# EAGLE design io-board (EAGLE 6.3)
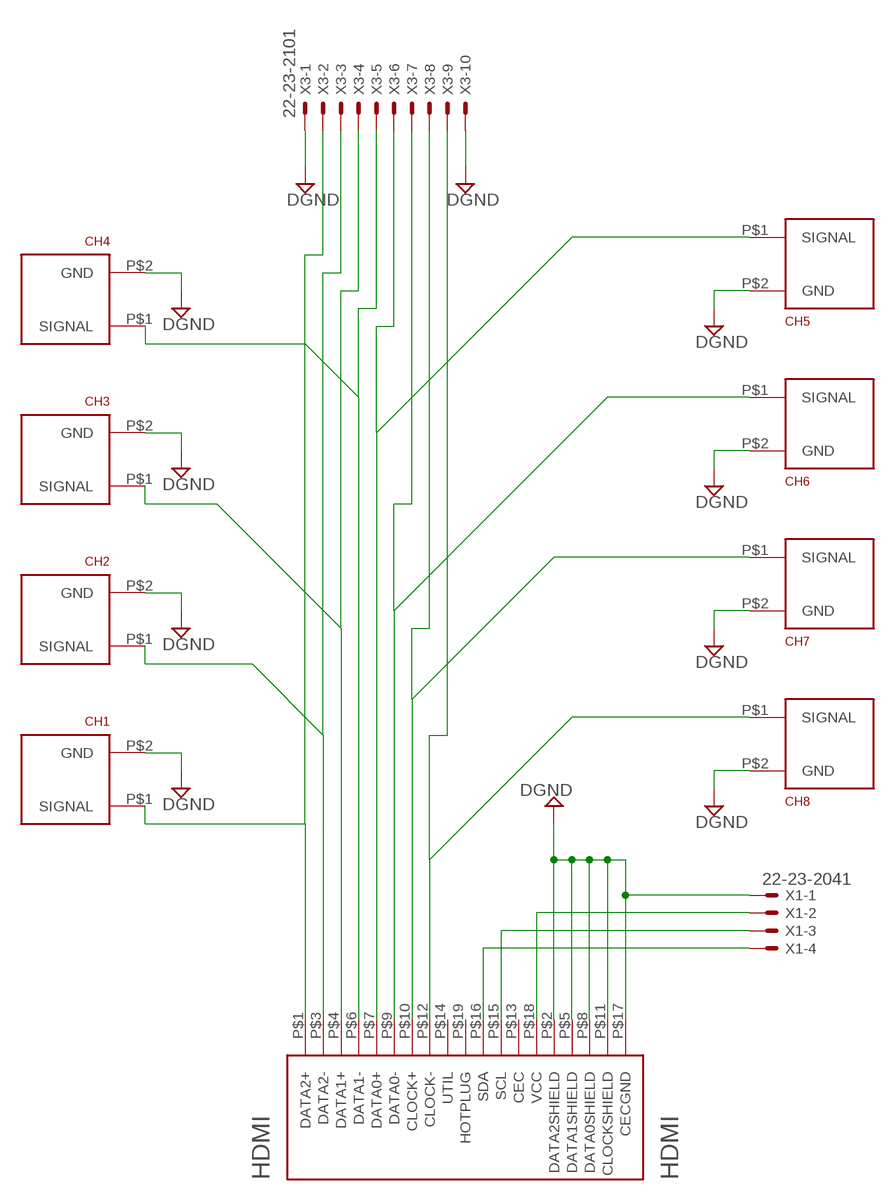
[diagram p0: schematic, sheet 1]

## Parts
CH1  BNC_VERTICAL  [BNC_VERTICAL]
CH2  BNC_VERTICAL  [BNC_VERTICAL]
CH3  BNC_VERTICAL  [BNC_VERTICAL]
CH4  BNC_VERTICAL  [BNC_VERTICAL]
CH5  BNC_VERTICAL  [BNC_VERTICAL]
CH6  BNC_VERTICAL  [BNC_VERTICAL]
CH7  BNC_VERTICAL  [BNC_VERTICAL]
CH8  BNC_VERTICAL  [BNC_VERTICAL]
HDMI  HDMI  [HDMI_A]
X1  22-23-2041  [22-23-2041]
X3  22-23-2101  [22-23-2101]

## Nets
CH6: CH6.P$1(SIGNAL) HDMI.P$9(DATA0-) X3.7
DGND: CH1.P$2(GND) CH2.P$2(GND) CH3.P$2(GND) CH4.P$2(GND) CH5.P$2(GND) CH6.P$2(GND) CH7.P$2(GND) CH8.P$2(GND) HDMI.P$2(DATA2SHIELD) HDMI.P$5(DATA1SHIELD) HDMI.P$8(DATA0SHIELD) HDMI.P$11(CLOCKSHIELD) HDMI.P$17(CECGND) X1.1 X3.1 X3.10
I2C_CLK: HDMI.P$15(SCL) X1.3
I2C_DAT: HDMI.P$16(SDA) X1.4
N$2: CH3.P$1(SIGNAL) HDMI.P$4(DATA1+) X3.4
N$3: CH2.P$1(SIGNAL) HDMI.P$3(DATA2-) X3.3
N$4: CH1.P$1(SIGNAL) HDMI.P$1(DATA2+) X3.2
N$5: CH5.P$1(SIGNAL) HDMI.P$7(DATA0+) X3.6
N$7: CH7.P$1(SIGNAL) HDMI.P$10(CLOCK+) X3.8
N$8: CH8.P$1(SIGNAL) HDMI.P$12(CLOCK-) X3.9
N$23: CH4.P$1(SIGNAL) HDMI.P$6(DATA1-) X3.5
VCC: HDMI.P$18(VCC) X1.2
Unconnected: HDMI.P$13(CEC) HDMI.P$14(UTIL) HDMI.P$19(HOTPLUG)

## Library data of the parts
CH1-CH8 = josh:BNC_VERTICAL
HDMI = open-ephys:HDMI: Horizonal HDMI type "A" jack
X1 = con-molex:22-23-2041: .100" (2.54mm) Center Header - 4 Pin; MF: MOLEX; MPN: 22-23-2041; OC_FARNELL: 1462920; OC_NEWARK: 38C0355
X3 = con-molex:22-23-2101: .100" (2.54mm) Center Header - 10 Pin; MF: MOLEX; MPN: 22-23-2101; OC_FARNELL: 1756828; OC_NEWARK: 94C0765

## Board
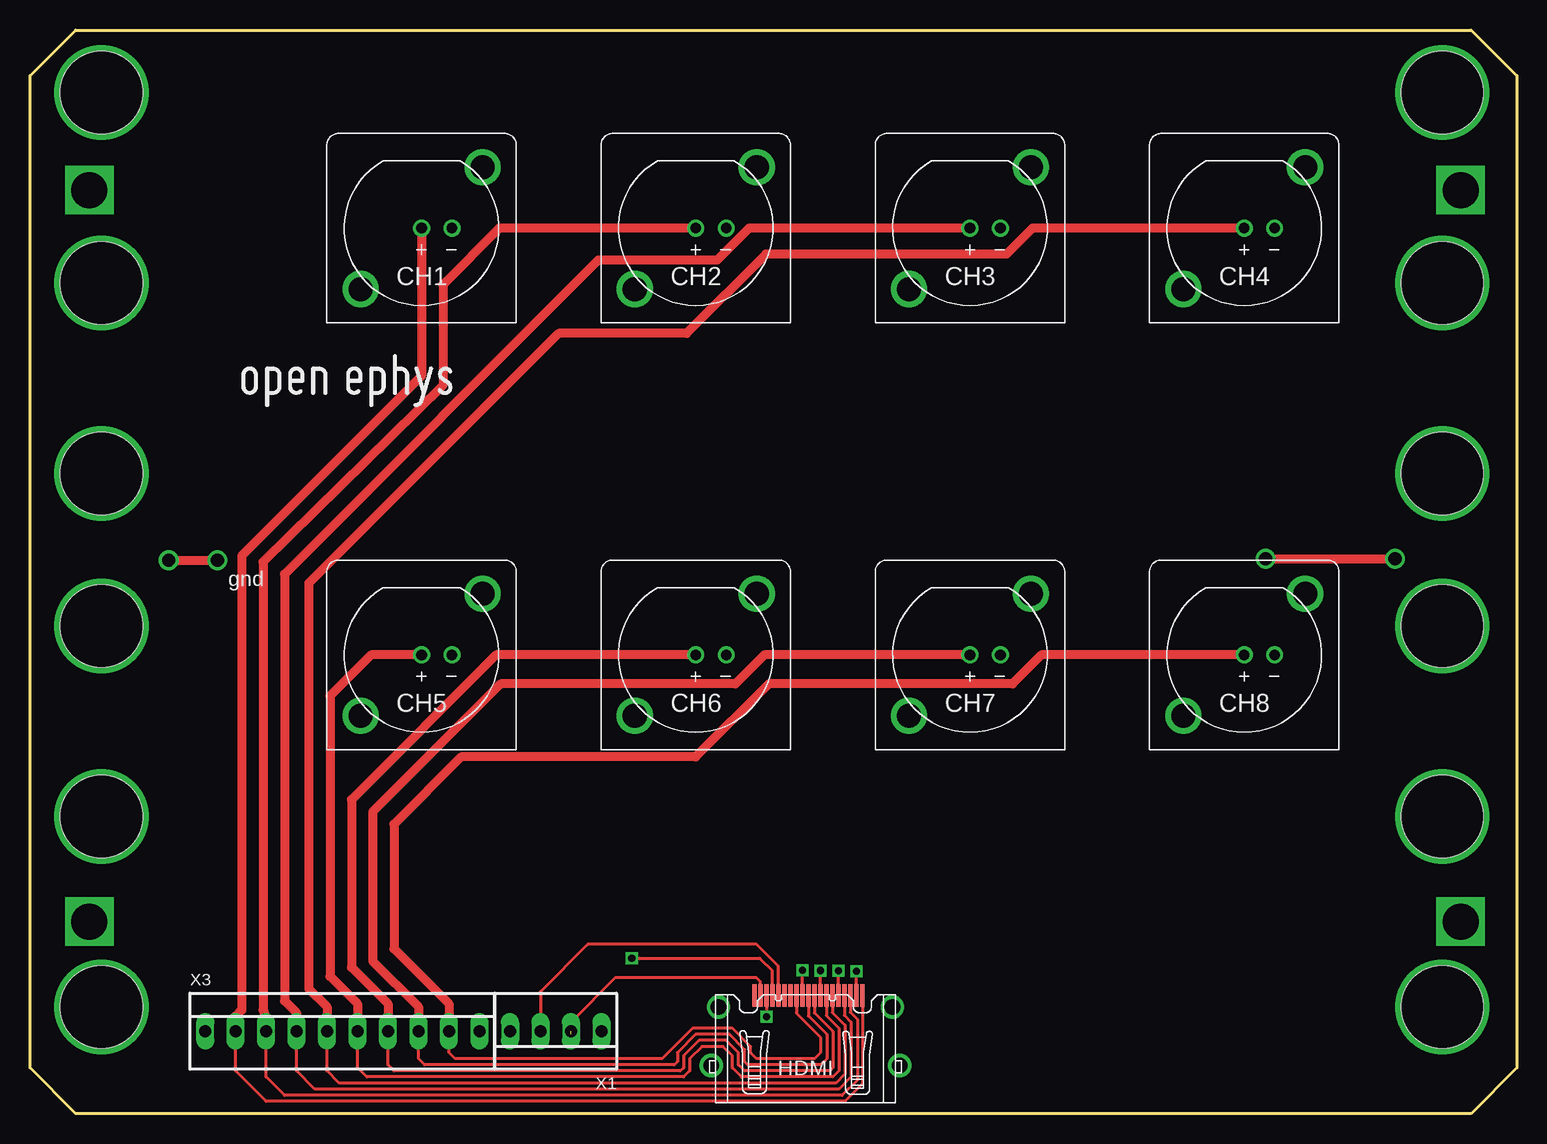
[diagram p1: board, top side]
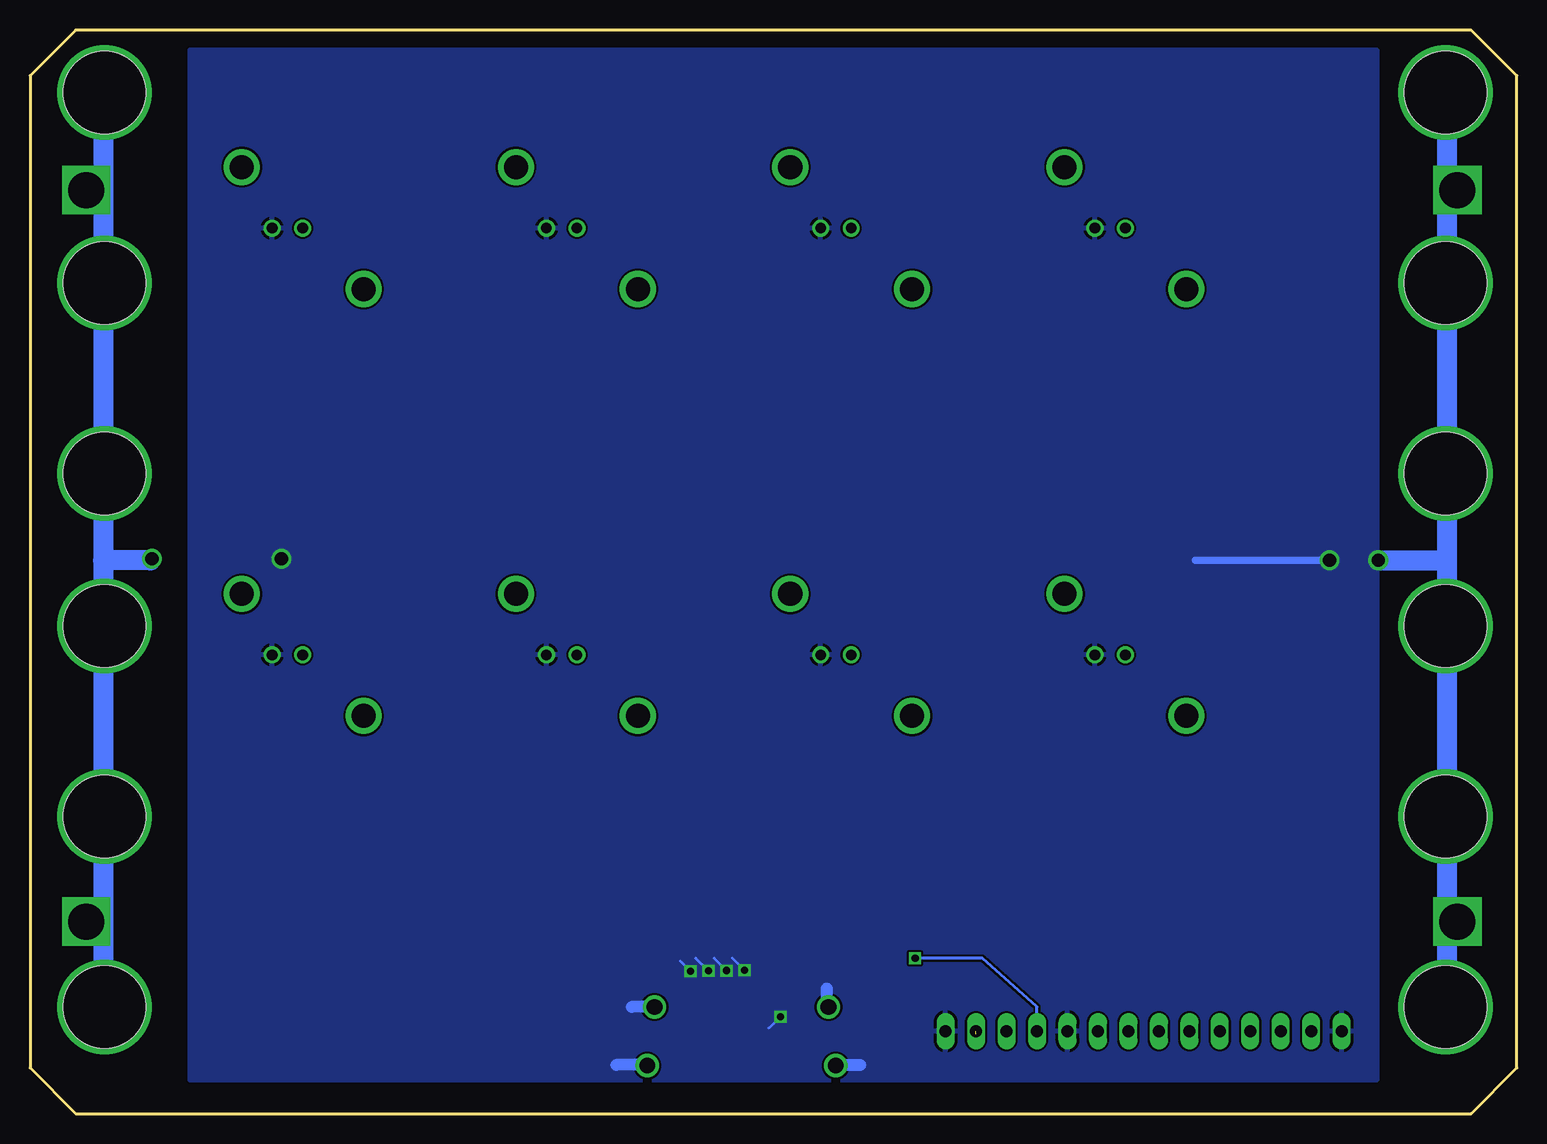
[diagram p2: board, bottom side, seen from below]

Size 123.95 x 90.3 mm. Coordinates in mm from the lower left corner, seen from the top.
Outline: 120.14,0 3.81,0 0,3.81 0,86.49 3.81,90.3 120.14,90.3 123.95,86.49 123.95,3.81 120.14,0
Copper layers (1*16): Top 0.035mm / dielectric 1.5mm / Bottom 0.035mm
Design rules "default": minimum track width 10mil, minimum drill 10mil, track to track 7mil, track to pad 7mil, pad to pad 7mil, via to via 7mil, smd to smd 7mil, copper to edge 25mil, drill to drill 7mil, minimum pad ring 10mil, minimum via ring 8mil, stop-mask expansion 4mil, vias tented up to drill 0mil, thermal gap 10mil
Holes 6.86 mm at 5.97,85.09 5.97,69.22 5.97,53.34 5.97,40.64 5.97,24.77 5.97,8.89 117.73,85.09 117.73,69.22 117.73,53.34 117.73,40.64 117.73,24.77 117.73,8.89

### Footprints (pad centres in the part's own frame; a part is rotated, then mirrored left to right if it is on the bottom)
BNC_VERTICAL = drill 0.89: P$1 0,0; P$2 2.54,0 | drill 2.01: P$3 5.08,5.08; P$4 -5.08,-5.08
HDMI_A = smd 0.3 x 1.9: P$1 4.75,0.95; P$2 4.25,0.95; P$3 3.75,0.95; P$4 3.25,0.95; P$5 2.75,0.95; P$6 2.25,0.95; P$7 1.75,0.95; P$8 1.25,0.95; P$9 0.75,0.95; P$10 0.25,0.95; P$11 -0.25,0.95; P$12 -0.75,0.95; P$13 -1.25,0.95; P$14 -1.75,0.95; P$15 -2.25,0.95; P$16 -2.75,0.95; P$17 -3.25,0.95; P$18 -3.75,0.95; P$19 -4.25,0.95 | drill 1.3: P$20 -7.25,0; P$21 7.25,0; P$22 7.85,-4.9; P$23 -7.85,-4.9
22-23-2041 = drill 1 long: 1 -3.81,0; 2 -1.27,0; 3 1.27,0; 4 3.81,0
22-23-2101 = drill 1 long: 1 -11.43,0; 2 -8.89,0; 3 -6.35,0; 4 -3.81,0; 5 -1.27,0; 6 1.27,0; 7 3.81,0; 8 6.35,0; 9 8.89,0; 10 11.43,0

### Placement (x,y rotation side)
CH1  32.64,73.79 0 top
CH2  55.5,73.79 0 top
CH3  78.36,73.79 0 top
CH4  101.22,73.79 0 top
CH5  32.64,38.23 0 top
CH6  55.5,38.23 0 top
CH7  78.36,38.23 0 top
CH8  101.22,38.23 0 top
HDMI  64.64,8.89 0 top
U$2  [OPEN_EPHYS_LOGO]  17.02,58.42 0 top
X1  43.81,6.86 180 top
X3  26.04,6.86 0 top

### Tracks (layer width: path | path; a pad name or v marks a point on that pad's centre or on a via)
CH6
  Top 0.254: 65.41,9.6 HDMI.P$9 65.39,8.39 66.93,6.86 66.93,3.81 66.68,3.56 59.56,3.56 59.05,4.06 59.05,5.08 58.04,6.1 55.75,6.1 54.48,4.83 54.48,3.81 54.23,3.56 30.35,3.56 29.85,4.06 X3.7
  Top 0.762: CH6.P$1 38.86,38.23 26.8,26.16 26.8,12.19 29.85,9.14 X3.7
DGND  (via drill 0.6, 1.1)
  Top 0.254: HDMI.P$2 v68.89,11.87 | HDMI.P$5 v67.39,11.89 | HDMI.P$8 v65.89,11.92 | HDMI.P$11 v64.39,11.94 | HDMI.P$17 v61.39,8.08
  Top 0.762: v11.56,46.1 v15.62,46.1 | v103,46.23 v113.79,46.23
  Bottom 0.254: v68.89,11.87 69.72,12.7 | v67.39,11.89 68.45,12.95 | v65.89,11.92 66.93,12.95 | v64.39,11.94 65.41,12.95 | v61.39,8.08 62.36,7.11
  Bottom 0.635: v15.62,46.1 26.8,46.1
  Bottom 1.016: 72.52,4.06 75.06,4.06 | 57.53,8.89 57.53,10.41 | 56.77,4.06 54.74,4.06 | 72.01,8.89 73.79,8.89
  Bottom 1.676: v11.56,46.1 5.84,46.1
  pour Bottom: 11.68,88.65 11.68,2.79 110.62,2.79 110.62,88.65
DGND1
  Bottom 1.676: 113.92,46.1 117.86,46.1
I2C_CLK
  Top 0.254: HDMI.P$15 62.39,12.28 60.58,14.1 46.48,14.1 42.54,10.16 X1.3
I2C_DAT  (via drill 0.6)
  Top 0.254: HDMI.P$16 61.89,11.89 60.83,12.95 v50.16,12.95
  Bottom 0.254: X1.4 40,8.89 44.58,12.95 v50.16,12.95
N$1  (via drill 3)
  other vias: 4.95,76.96
N$2
  Top 0.254: HDMI.P$4 67.89,8.18 68.45,7.62 68.45,3.05 67.44,2.03 23.75,2.03 22.23,3.56 X3.4
  Top 0.762: CH3.P$1 59.94,73.79 57.28,71.12 47.37,71.12 21.21,44.96 21.21,9.4 22.23,8.38 X3.4
N$3
  Top 0.254: HDMI.P$3 68.39,8.44 68.96,7.87 68.96,2.79 67.69,1.52 21.21,1.52 19.69,3.05 X3.3
  Top 0.762: CH2.P$1 39.12,73.79 34.42,69.09 34.42,60.71 19.43,45.97 19.43,8.64 19.69,7.87 X3.3
N$4
  Top 0.254: HDMI.P$1 69.39,2.46 67.95,1.02 19.69,1.02 17.14,3.56 X3.2
  Top 0.762: CH1.P$1 32.64,61.47 17.65,46.48 17.65,8.64 17.14,8.13 X3.2
N$5
  Top 0.254: HDMI.P$7 66.39,8.16 67.44,7.11 67.44,3.56 66.93,3.05 59.31,3.05 58.55,3.81 58.55,4.83 57.78,5.59 56.01,5.59 54.99,4.57 54.99,3.56 54.48,3.05 28.07,3.05 27.3,3.81 X3.6
  Top 0.762: CH5.P$1 28.45,38.23 25.02,34.8 25.02,11.43 27.3,9.14 X3.6
N$6  (via drill 3)
  other vias: 4.95,16
N$7
  Top 0.254: HDMI.P$10 64.89,8.13 66.42,6.6 66.42,4.57 65.91,4.06 59.82,4.06 59.56,4.32 59.56,5.33 58.29,6.6 55.5,6.6 53.97,5.08 53.97,4.32 53.72,4.06 32.89,4.06 32.38,4.57 X3.8
  Top 0.762: CH7.P$1 61.21,38.23 58.8,35.81 39.24,35.81 28.58,25.15 28.58,12.7 32.38,8.89 X3.8
N$8
  Top 0.254: HDMI.P$12 63.89,8.37 65.91,6.35 65.91,5.08 65.41,4.57 60.58,4.57 60.07,5.08 60.07,5.59 58.55,7.11 55.24,7.11 52.7,4.57 35.43,4.57 34.92,5.08 X3.9
  Top 0.762: CH8.P$1 84.33,38.23 81.92,35.81 61.59,35.81 55.5,29.72 35.94,29.72 30.35,24.13 30.35,13.72 34.92,9.14 X3.9
N$9  (via drill 3)
  other vias: 119.25,16
N$10  (via drill 3)
  other vias: 119.25,76.96
N$23
  Top 0.254: HDMI.P$6 66.89,8.42 67.95,7.37 67.95,3.3 67.18,2.54 25.78,2.54 24.77,3.56 X3.5
  Top 0.762: CH4.P$1 83.57,73.79 81.41,71.63 61.34,71.63 54.74,65.02 44.07,65.02 23.24,44.2 23.24,10.41 24.77,8.89 X3.5
S$1  (via drill 6.86)
  other vias: 5.97,85.09
S$2  (via drill 6.86)
  other vias: 5.97,69.22
S$3  (via drill 6.86)
  other vias: 5.97,53.34
S$4  (via drill 6.86)
  other vias: 5.97,40.64
S$5  (via drill 6.86)
  other vias: 5.97,24.77
S$6  (via drill 6.86)
  other vias: 5.97,8.89
S$7  (via drill 6.86)
  other vias: 117.73,85.09
S$8  (via drill 6.86)
  other vias: 117.73,69.22
S$9  (via drill 6.86)
  other vias: 117.73,53.34
S$10  (via drill 6.86)
  other vias: 117.73,40.64
S$11  (via drill 6.86)
  other vias: 117.73,24.77
S$12  (via drill 6.86)
  other vias: 117.73,8.89
S$13
  Bottom 1.676: 5.84,84.33 5.84,10.41
S$14
  Bottom 1.676: 117.86,84.58 117.86,8.38
VCC  (1 unrouted)
  Top 0.254: HDMI.P$18 60.89,10.99 60.58,11.3 48.77,11.3 45.09,7.62 45.09,6.6

### Text on the board
tNames: gnd
tDocu: 1 | 2 | 3 | 4 | I/O Board | version 1.3 | May 2013 | 5 | 6 | 7 | 8 | 1 2 3 4 5 6 7 8 | 5vdc | gnd | gnd | gnd | i2c dat | i2c clk